# Altium schematic sheet lasers.SchDoc
size Letter
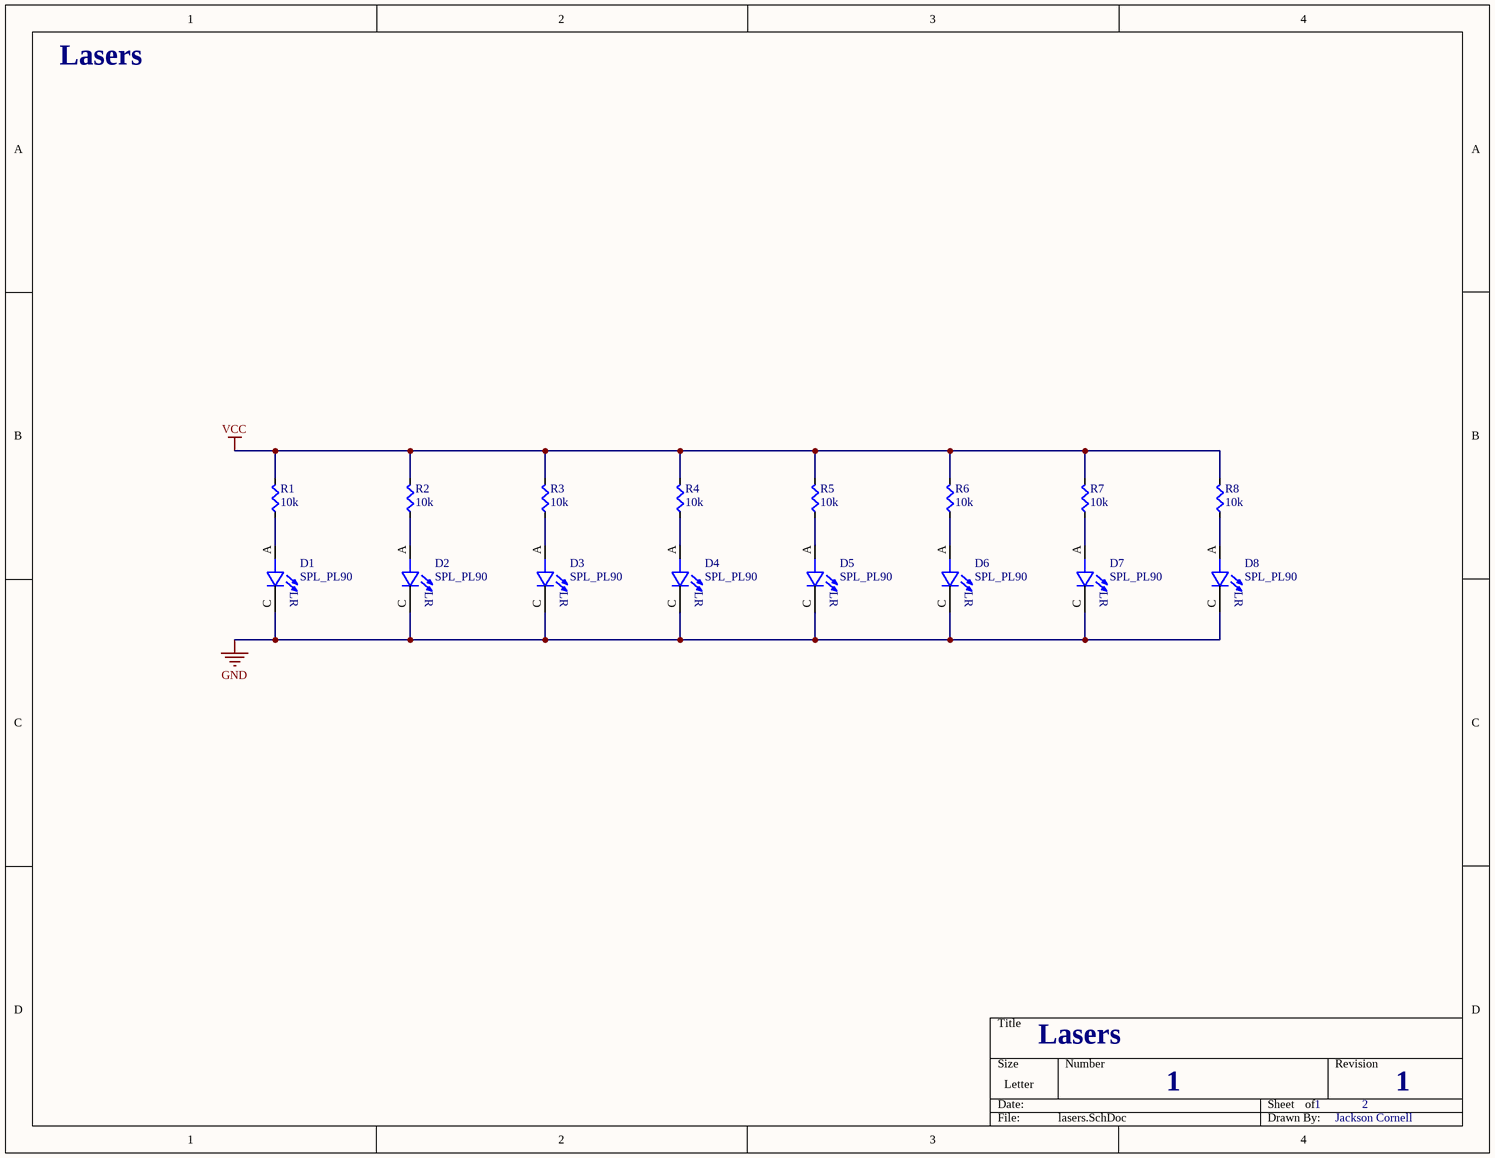
[diagram p0: lasers.SchDoc]

## Parts
D1  SPL_PL90  [LEDRD254W40D590H700]
D2  SPL_PL90  [LEDRD254W40D590H700]
D3  SPL_PL90  [LEDRD254W40D590H700]
D4  SPL_PL90  [LEDRD254W40D590H700]
D5  SPL_PL90  [LEDRD254W40D590H700]
D6  SPL_PL90  [LEDRD254W40D590H700]
D7  SPL_PL90  [LEDRD254W40D590H700]
D8  SPL_PL90  [LEDRD254W40D590H700]
R1  value 10k  [RES0603]  (hidden comment: Res)
R2  value 10k  [RES0603]  (hidden comment: Res)
R3  value 10k  [RES0603]  (hidden comment: Res)
R4  value 10k  [RES0603]  (hidden comment: Res)
R5  value 10k  [RES0603]  (hidden comment: Res)
R6  value 10k  [RES0603]  (hidden comment: Res)
R7  value 10k  [RES0603]  (hidden comment: Res)
R8  value 10k  [RES0603]  (hidden comment: Res)

## Nets
GND: D1.C D2.C D3.C D4.C D5.C D6.C D7.C D8.C
VCC: R1.1(A) R2.1(A) R3.1(A) R4.1(A) R5.1(A) R6.1(A) R7.1(A) R8.1(A)
NetD1_A: D1.A R1.2(B)
NetD2_A: D2.A R2.2(B)
NetD3_A: D3.A R3.2(B)
NetD4_A: D4.A R4.2(B)
NetD5_A: D5.A R5.2(B)
NetD6_A: D6.A R6.2(B)
NetD7_A: D7.A R7.2(B)
NetD8_A: D8.A R8.2(B)

## Notes on the sheet
- Lasers
- 1
- 2
- Jackson Cornell
- (in symbol SPL_PL90) LR

## Library data of the parts
D1-D8 = SPL_PL90: Laser Diode 905nm 90W 8 ~ 11V 40A Radial, Can _5.7mm_; MP: SPL PL90; MF: OSRAM Opto; SnapEDA_Link: https://www.snapeda.com/parts/SPL%20PL90/OSRAM%20Opto%20Semiconductors%20Inc./view-part/3590149/?ref=snap; Value: *; Package: Radial OSRAM Opto; Price: None; Availability: Unavailable
R1-R8 = Res: Supplier 1: Digi-Key; Supplier Part Number 1: RMCF0603JT10K0CT-ND